# Altium schematic sheet LED_Readout_and_Warning_Lights.SchDoc
size C
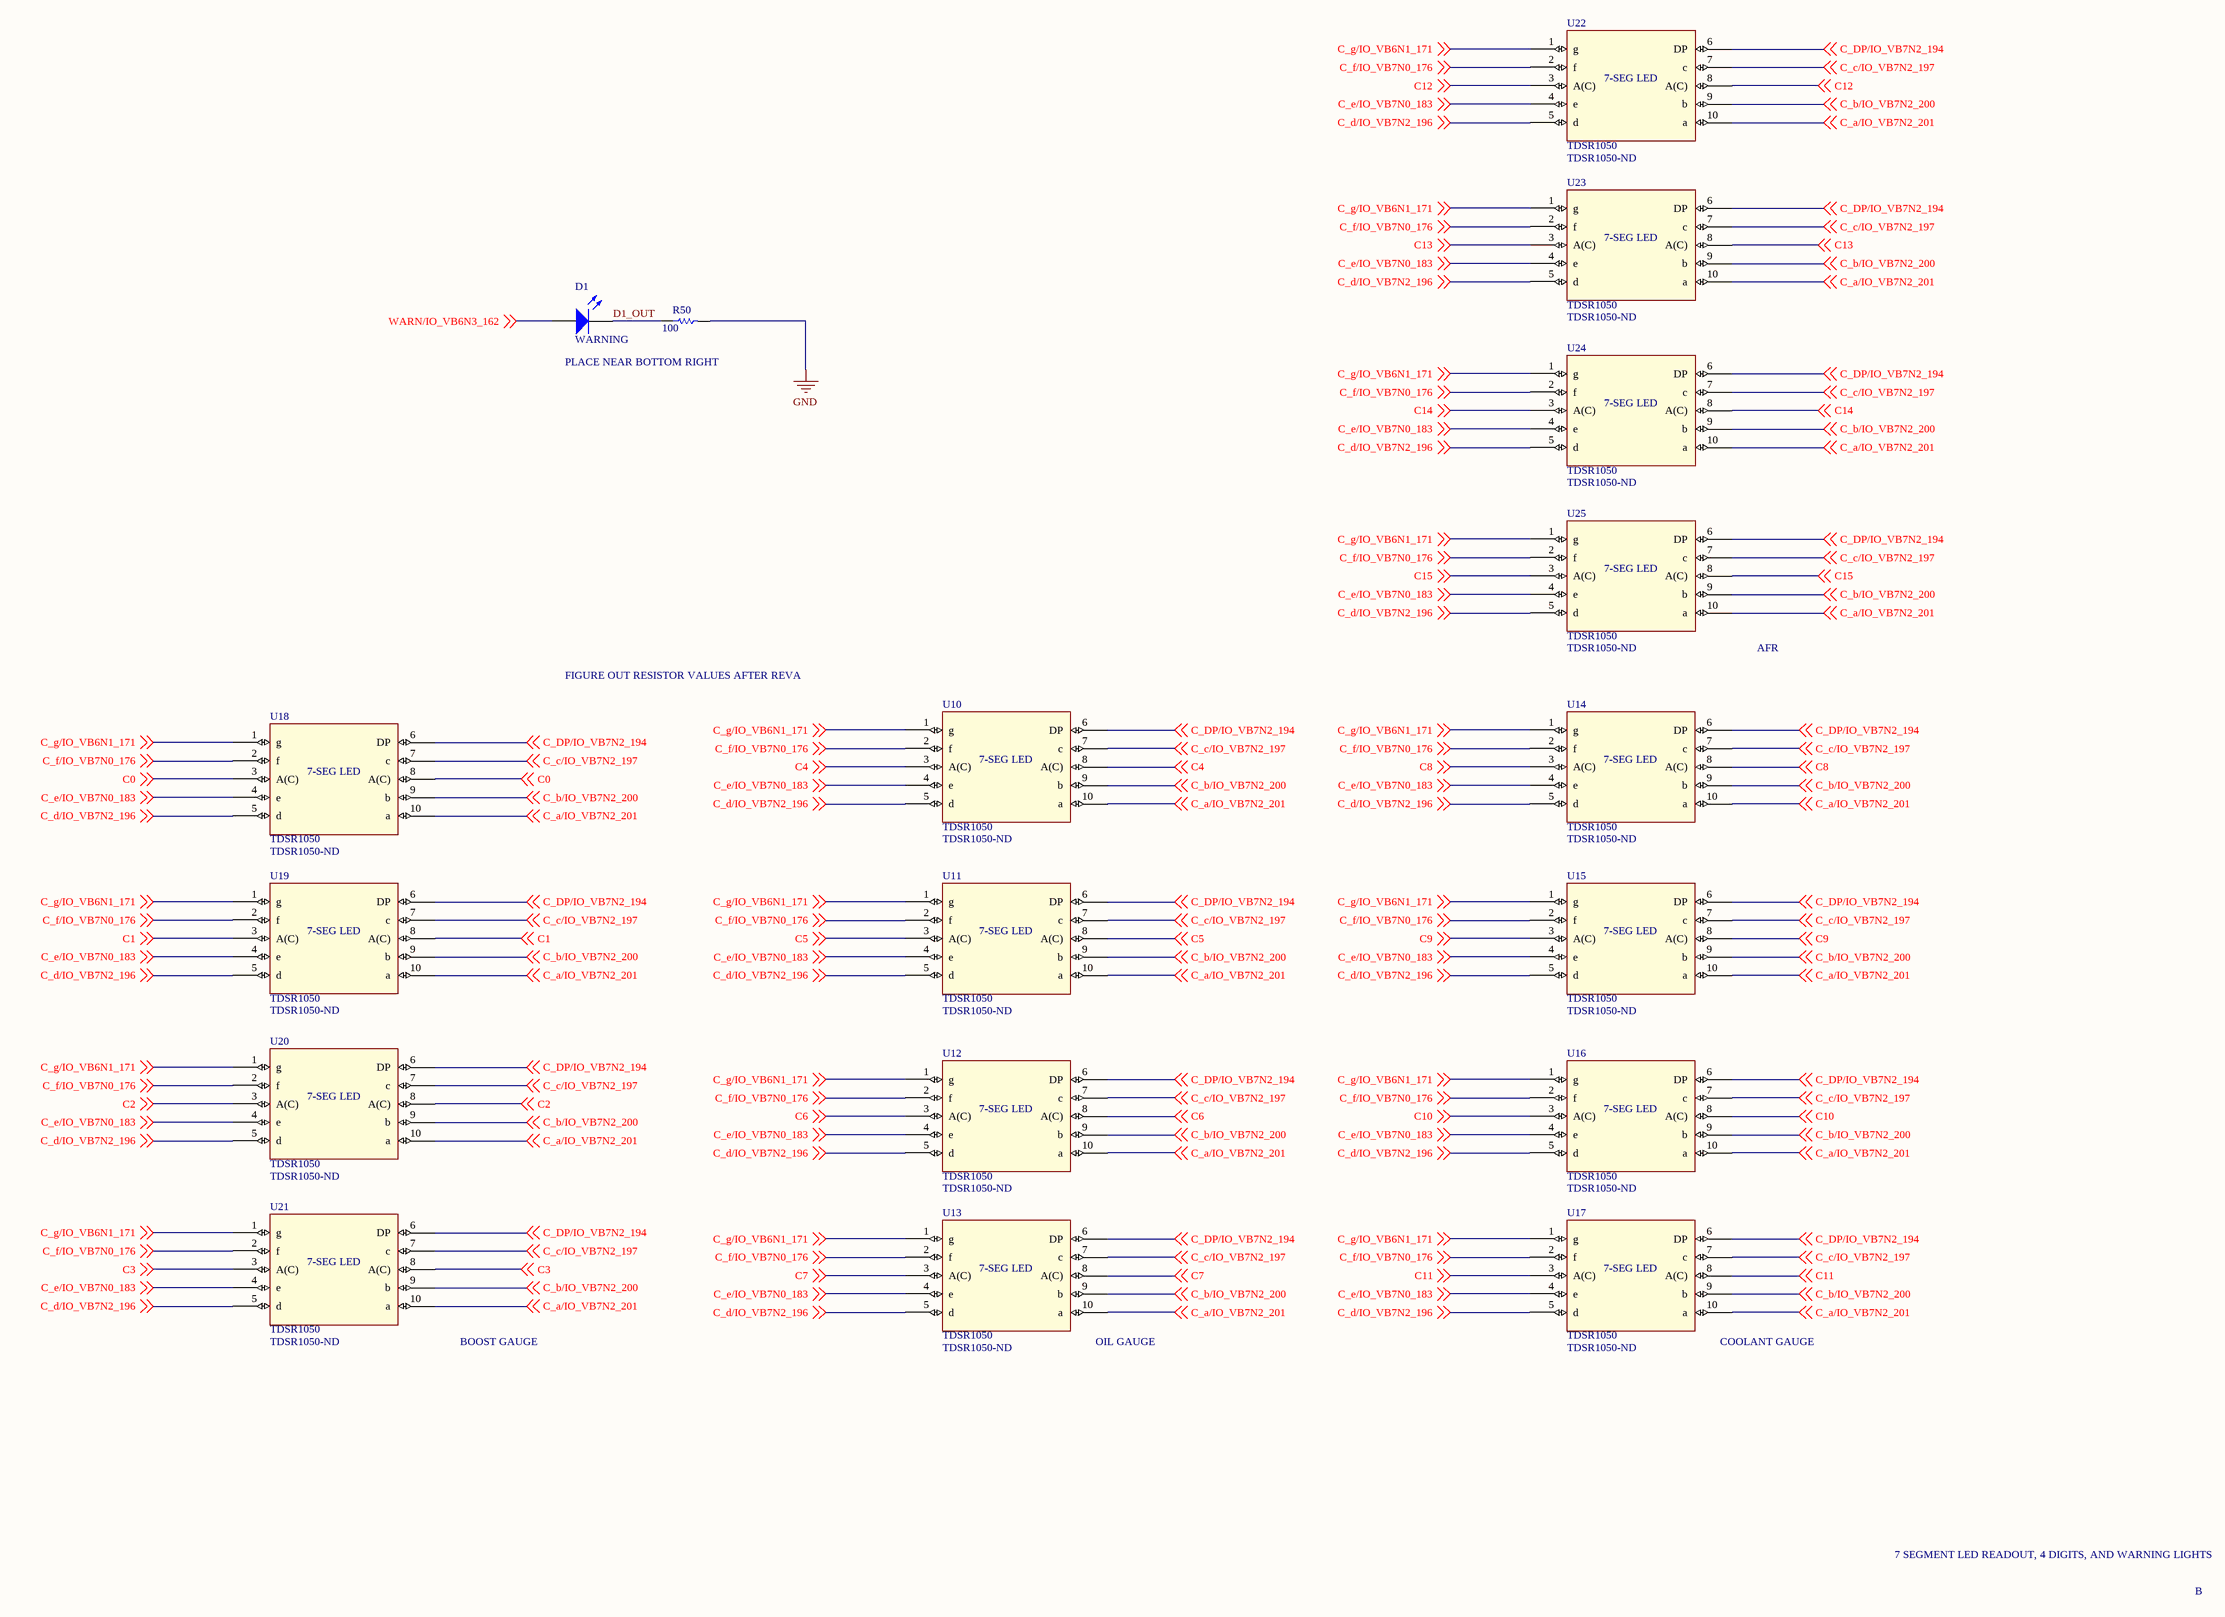
[diagram p0: LED_Readout_and_Warning_Lights.SchDoc]

## Parts
D1  WARNING  [DIODE_0603]
R50  value 100  [RES_0603]  (hidden comment: Figure out ohmage after RevA)
U10  TDSR1050  Supplier Part Number 1: TDSR1050-ND  [TDSR1050]
U11  TDSR1050  Supplier Part Number 1: TDSR1050-ND  [TDSR1050]
U12  TDSR1050  Supplier Part Number 1: TDSR1050-ND  [TDSR1050]
U13  TDSR1050  Supplier Part Number 1: TDSR1050-ND  [TDSR1050]
U14  TDSR1050  Supplier Part Number 1: TDSR1050-ND  [TDSR1050]
U15  TDSR1050  Supplier Part Number 1: TDSR1050-ND  [TDSR1050]
U16  TDSR1050  Supplier Part Number 1: TDSR1050-ND  [TDSR1050]
U17  TDSR1050  Supplier Part Number 1: TDSR1050-ND  [TDSR1050]
U18  TDSR1050  Supplier Part Number 1: TDSR1050-ND  [TDSR1050]
U19  TDSR1050  Supplier Part Number 1: TDSR1050-ND  [TDSR1050]
U20  TDSR1050  Supplier Part Number 1: TDSR1050-ND  [TDSR1050]
U21  TDSR1050  Supplier Part Number 1: TDSR1050-ND  [TDSR1050]
U22  TDSR1050  Supplier Part Number 1: TDSR1050-ND  [TDSR1050]
U23  TDSR1050  Supplier Part Number 1: TDSR1050-ND  [TDSR1050]
U24  TDSR1050  Supplier Part Number 1: TDSR1050-ND  [TDSR1050]
U25  TDSR1050  Supplier Part Number 1: TDSR1050-ND  [TDSR1050]

## Nets
GND: R50.2
C0: U18.3(A(C)) U18.8(A(C)) ; off-sheet C0
C1: U19.3(A(C)) U19.8(A(C)) ; off-sheet C1
C2: U20.3(A(C)) U20.8(A(C)) ; off-sheet C2
C3: U21.3(A(C)) U21.8(A(C)) ; off-sheet C3
C4: U10.3(A(C)) U10.8(A(C)) ; off-sheet C4
C5: U11.3(A(C)) U11.8(A(C)) ; off-sheet C5
C6: U12.3(A(C)) U12.8(A(C)) ; off-sheet C6
C7: U13.3(A(C)) U13.8(A(C)) ; off-sheet C7
C8: U14.3(A(C)) U14.8(A(C)) ; off-sheet C8
C9: U15.3(A(C)) U15.8(A(C)) ; off-sheet C9
C10: U16.3(A(C)) U16.8(A(C)) ; off-sheet C10
C11: U17.3(A(C)) U17.8(A(C)) ; off-sheet C11
C12: U22.3(A(C)) U22.8(A(C)) ; off-sheet C12
C13: U23.3(A(C)) U23.8(A(C)) ; off-sheet C13
C14: U24.3(A(C)) U24.8(A(C)) ; off-sheet C14
C15: U25.3(A(C)) U25.8(A(C)) ; off-sheet C15
C_a/IO_VB7N2_201: U10.10(a) U11.10(a) U12.10(a) U13.10(a) U14.10(a) U15.10(a) U16.10(a) U17.10(a) U18.10(a) U19.10(a) U20.10(a) U21.10(a) U22.10(a) U23.10(a) U24.10(a) U25.10(a) ; off-sheet C_a/IO_VB7N2_201
C_b/IO_VB7N2_200: U10.9(b) U11.9(b) U12.9(b) U13.9(b) U14.9(b) U15.9(b) U16.9(b) U17.9(b) U18.9(b) U19.9(b) U20.9(b) U21.9(b) U22.9(b) U23.9(b) U24.9(b) U25.9(b) ; off-sheet C_b/IO_VB7N2_200
C_c/IO_VB7N2_197: U10.7(c) U11.7(c) U12.7(c) U13.7(c) U14.7(c) U15.7(c) U16.7(c) U17.7(c) U18.7(c) U19.7(c) U20.7(c) U21.7(c) U22.7(c) U23.7(c) U24.7(c) U25.7(c) ; off-sheet C_c/IO_VB7N2_197
C_d/IO_VB7N2_196: U10.5(d) U11.5(d) U12.5(d) U13.5(d) U14.5(d) U15.5(d) U16.5(d) U17.5(d) U18.5(d) U19.5(d) U20.5(d) U21.5(d) U22.5(d) U23.5(d) U24.5(d) U25.5(d) ; off-sheet C_d/IO_VB7N2_196
C_DP/IO_VB7N2_194: U10.6(DP) U11.6(DP) U12.6(DP) U13.6(DP) U14.6(DP) U15.6(DP) U16.6(DP) U17.6(DP) U18.6(DP) U19.6(DP) U20.6(DP) U21.6(DP) U22.6(DP) U23.6(DP) U24.6(DP) U25.6(DP) ; off-sheet C_DP/IO_VB7N2_194
C_e/IO_VB7N0_183: U10.4(e) U11.4(e) U12.4(e) U13.4(e) U14.4(e) U15.4(e) U16.4(e) U17.4(e) U18.4(e) U19.4(e) U20.4(e) U21.4(e) U22.4(e) U23.4(e) U24.4(e) U25.4(e) ; off-sheet C_e/IO_VB7N0_183
C_f/IO_VB7N0_176: U10.2(f) U11.2(f) U12.2(f) U13.2(f) U14.2(f) U15.2(f) U16.2(f) U17.2(f) U18.2(f) U19.2(f) U20.2(f) U21.2(f) U22.2(f) U23.2(f) U24.2(f) U25.2(f) ; off-sheet C_f/IO_VB7N0_176
C_g/IO_VB6N1_171: U10.1(g) U11.1(g) U12.1(g) U13.1(g) U14.1(g) U15.1(g) U16.1(g) U17.1(g) U18.1(g) U19.1(g) U20.1(g) U21.1(g) U22.1(g) U23.1(g) U24.1(g) U25.1(g) ; off-sheet C_g/IO_VB6N1_171
D1_OUT: D1.2(K) R50.1
WARN/IO_VB6N3_162: D1.1(A) ; off-sheet WARN/IO_VB6N3_162

## Notes on the sheet
- PLACE NEAR BOTTOM RIGHT
- AFR
- FIGURE OUT RESISTOR VALUES AFTER REVA
- BOOST GAUGE
- (near U13) OIL GAUGE
- (near U17) COOLANT GAUGE
- 7 SEGMENT LED READOUT, 4 DIGITS, AND WARNING LIGHTS
- B
- (in symbol TDSR1050) 7-SEG LED

## Library data of the parts
D1 = LED0: Typical INFRARED GaAs LED; Published: 8-Jun-2000; LatestRevisionDate: 08-Jul-2005; LatestRevisionNote: Mech Layer 1 removed.; PackageReference: LED-0; Publisher: Altium Limited; PackageDescription: LED; 2 Leads
R50 = Res1: Resistor; Published: 8-Jun-2000; LatestRevisionDate: 17-Jul-2002; LatestRevisionNote: Re-released for DXP Platform.; PackageReference: AXIAL-0.3; Publisher: Altium Limited; PackageDescription: Axial Device, Thru-Hole; 2 Leads; 0.3 in Pin Spacing
U10-U25 = TDSR1050: High Intensity Red Low Current 7-Segment Display; Supplier 1: Digi-Key